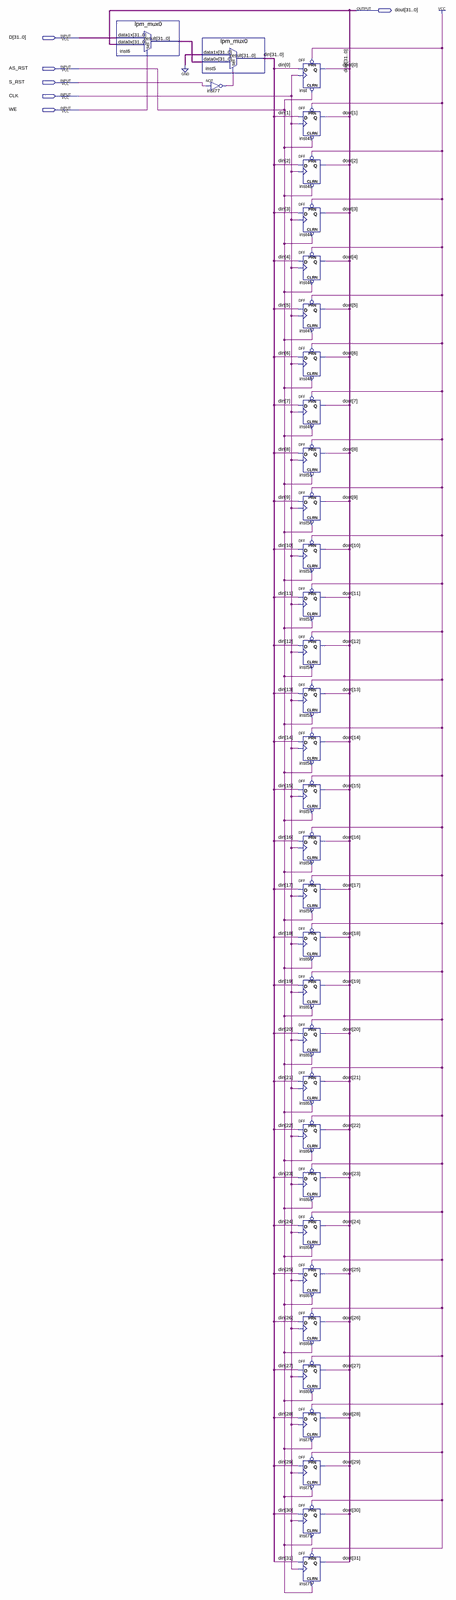
[diagram p0: schematic sheet, whole]
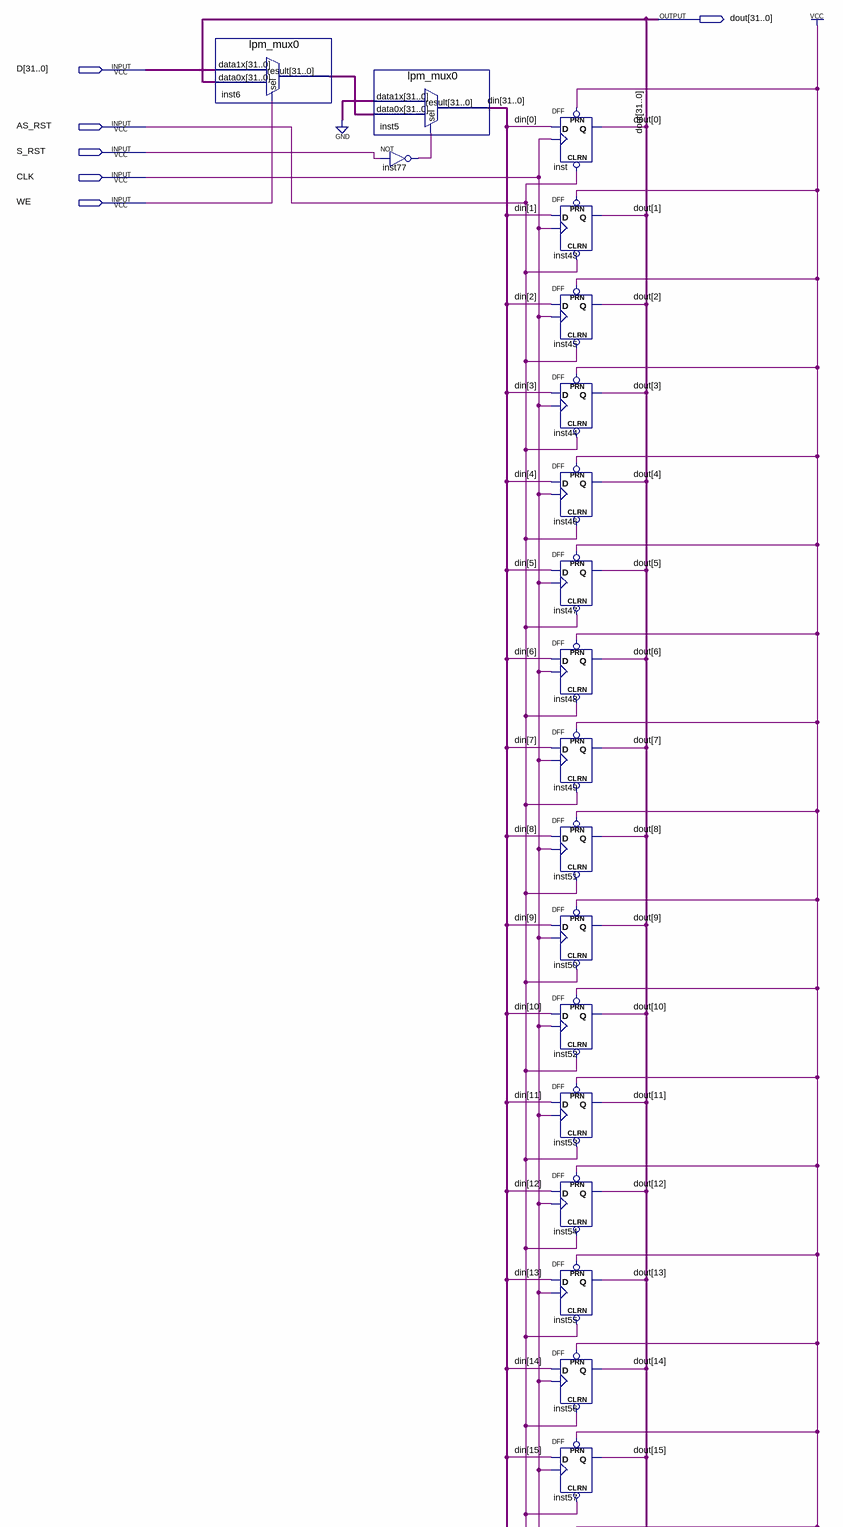
[diagram p1: schematic sheet, upper part]
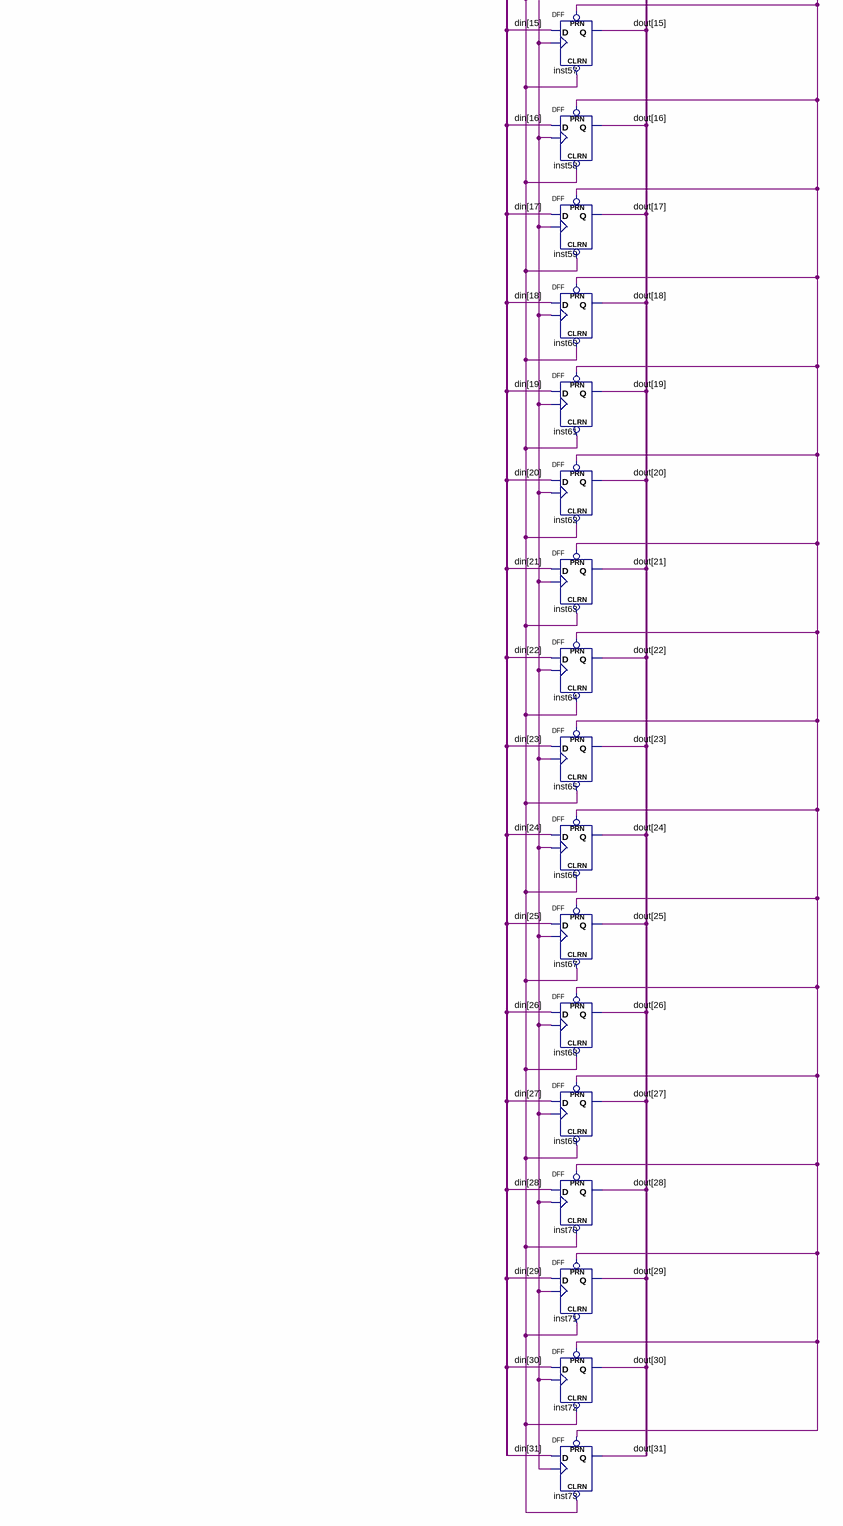
[diagram p2: schematic sheet, lower part]
// Quartus schematic register.bdf as structural Verilog: 35 symbols, 6 pins
module register (
  input  [31:0] D,
  input  AS_RST,
  input  S_RST,
  input  CLK,
  input  WE,
  output [31:0] dout
);

  wire inst77_out;
  wire [31:0] din, inst6_result;

  lpm_mux0 inst6 (.data1x(D), .data0x(dout), .sel(WE), .result(inst6_result));
  lpm_mux0 inst5 (.data1x({32{1'b0}}), .data0x(inst6_result), .sel(inst77_out), .result(din));
  not inst77 (inst77_out, S_RST);
  DFF inst (.CLRN(AS_RST), .CLK(CLK), .D(din[0]), .PRN(1'b1), .Q(dout[0]));
  DFF inst43 (.CLRN(AS_RST), .CLK(CLK), .D(din[1]), .PRN(1'b1), .Q(dout[1]));
  DFF inst45 (.CLRN(AS_RST), .CLK(CLK), .D(din[2]), .PRN(1'b1), .Q(dout[2]));
  DFF inst44 (.CLRN(AS_RST), .CLK(CLK), .D(din[3]), .PRN(1'b1), .Q(dout[3]));
  DFF inst46 (.CLRN(AS_RST), .CLK(CLK), .D(din[4]), .PRN(1'b1), .Q(dout[4]));
  DFF inst47 (.CLRN(AS_RST), .CLK(CLK), .D(din[5]), .PRN(1'b1), .Q(dout[5]));
  DFF inst48 (.CLRN(AS_RST), .CLK(CLK), .D(din[6]), .PRN(1'b1), .Q(dout[6]));
  DFF inst49 (.CLRN(AS_RST), .CLK(CLK), .D(din[7]), .PRN(1'b1), .Q(dout[7]));
  DFF inst51 (.CLRN(AS_RST), .CLK(CLK), .D(din[8]), .PRN(1'b1), .Q(dout[8]));
  DFF inst50 (.CLRN(AS_RST), .CLK(CLK), .D(din[9]), .PRN(1'b1), .Q(dout[9]));
  DFF inst52 (.CLRN(AS_RST), .CLK(CLK), .D(din[10]), .PRN(1'b1), .Q(dout[10]));
  DFF inst53 (.CLRN(AS_RST), .CLK(CLK), .D(din[11]), .PRN(1'b1), .Q(dout[11]));
  DFF inst54 (.CLRN(AS_RST), .CLK(CLK), .D(din[12]), .PRN(1'b1), .Q(dout[12]));
  DFF inst55 (.CLRN(AS_RST), .CLK(CLK), .D(din[13]), .PRN(1'b1), .Q(dout[13]));
  DFF inst56 (.CLRN(AS_RST), .CLK(CLK), .D(din[14]), .PRN(1'b1), .Q(dout[14]));
  DFF inst57 (.CLRN(AS_RST), .CLK(CLK), .D(din[15]), .PRN(1'b1), .Q(dout[15]));
  DFF inst58 (.CLRN(AS_RST), .CLK(CLK), .D(din[16]), .PRN(1'b1), .Q(dout[16]));
  DFF inst59 (.CLRN(AS_RST), .CLK(CLK), .D(din[17]), .PRN(1'b1), .Q(dout[17]));
  DFF inst60 (.CLRN(AS_RST), .CLK(CLK), .D(din[18]), .PRN(1'b1), .Q(dout[18]));
  DFF inst61 (.CLRN(AS_RST), .CLK(CLK), .D(din[19]), .PRN(1'b1), .Q(dout[19]));
  DFF inst62 (.CLRN(AS_RST), .CLK(CLK), .D(din[20]), .PRN(1'b1), .Q(dout[20]));
  DFF inst63 (.CLRN(AS_RST), .CLK(CLK), .D(din[21]), .PRN(1'b1), .Q(dout[21]));
  DFF inst64 (.CLRN(AS_RST), .CLK(CLK), .D(din[22]), .PRN(1'b1), .Q(dout[22]));
  DFF inst65 (.CLRN(AS_RST), .CLK(CLK), .D(din[23]), .PRN(1'b1), .Q(dout[23]));
  DFF inst66 (.CLRN(AS_RST), .CLK(CLK), .D(din[24]), .PRN(1'b1), .Q(dout[24]));
  DFF inst67 (.CLRN(AS_RST), .CLK(CLK), .D(din[25]), .PRN(1'b1), .Q(dout[25]));
  DFF inst68 (.CLRN(AS_RST), .CLK(CLK), .D(din[26]), .PRN(1'b1), .Q(dout[26]));
  DFF inst69 (.CLRN(AS_RST), .CLK(CLK), .D(din[27]), .PRN(1'b1), .Q(dout[27]));
  DFF inst70 (.CLRN(AS_RST), .CLK(CLK), .D(din[28]), .PRN(1'b1), .Q(dout[28]));
  DFF inst71 (.CLRN(AS_RST), .CLK(CLK), .D(din[29]), .PRN(1'b1), .Q(dout[29]));
  DFF inst72 (.CLRN(AS_RST), .CLK(CLK), .D(din[30]), .PRN(1'b1), .Q(dout[30]));
  DFF inst73 (.CLRN(AS_RST), .CLK(CLK), .D(din[31]), .PRN(1'b1), .Q(dout[31]));
endmodule
